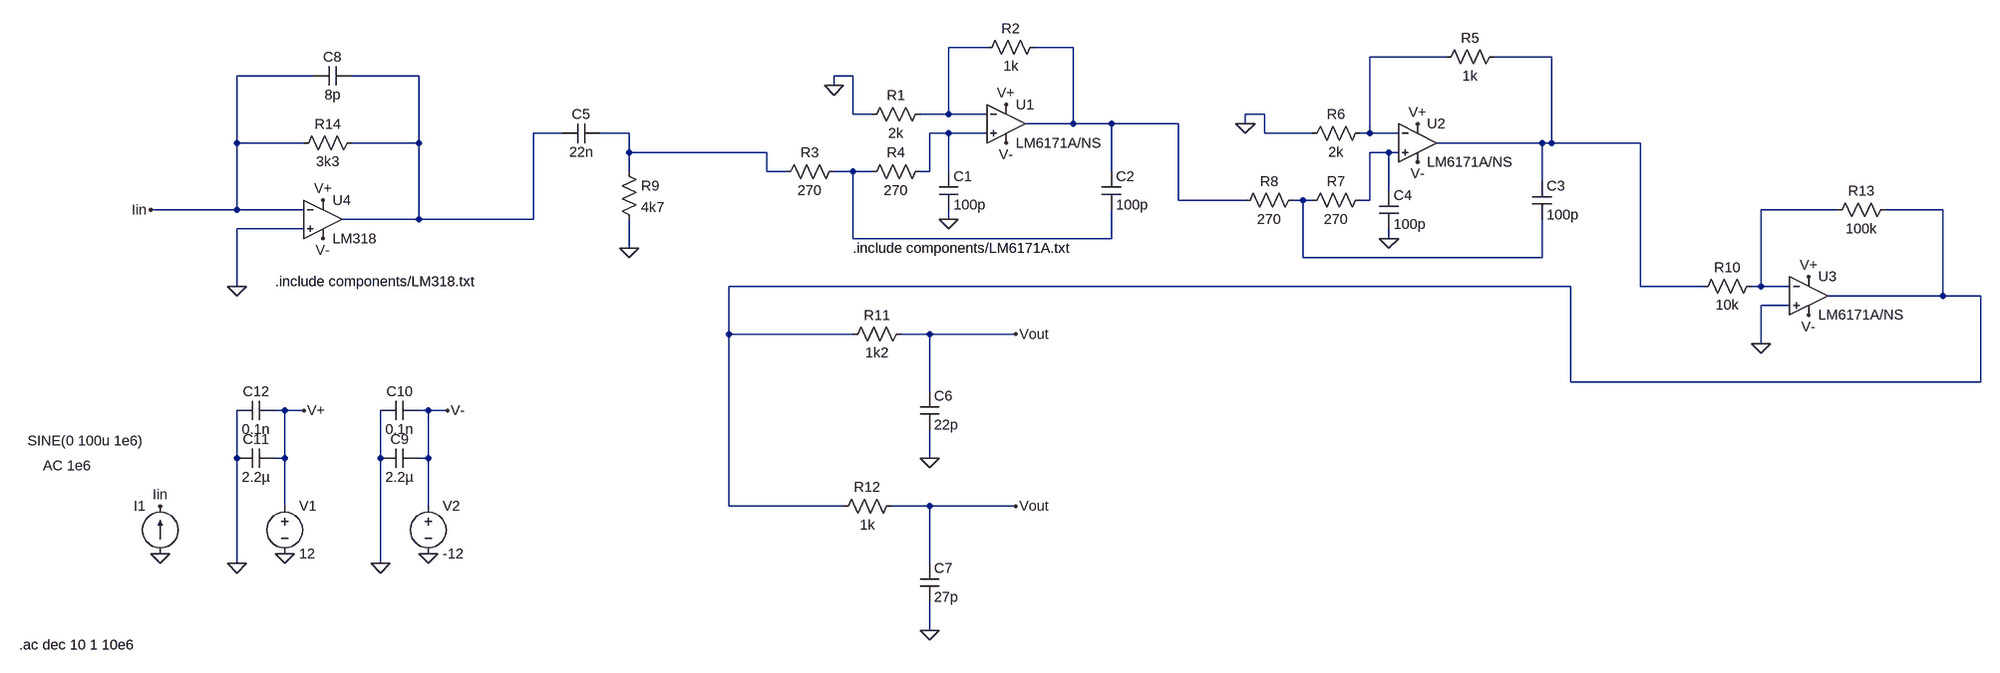
[diagram p0: schematic stage-4-LM318-sullen-key-linked.asc]
stage-4-LM318-sullen-key-linked.asc, the LTspice schematic file:
Version 4
SHEET 1 1972 1252
WIRE 176 32 112 32
WIRE 320 32 256 32
WIRE 944 48 816 48
WIRE 1120 48 1024 48
WIRE -992 80 -1120 80
WIRE -816 80 -928 80
WIRE -48 80 -80 80
WIRE -80 96 -80 80
WIRE -48 144 -48 80
WIRE -16 144 -48 144
WIRE 112 144 112 32
WIRE 112 144 64 144
WIRE 176 144 112 144
WIRE 640 144 608 144
WIRE 320 160 320 32
WIRE 320 160 240 160
WIRE 384 160 320 160
WIRE 496 160 384 160
WIRE 608 160 608 144
WIRE -576 176 -624 176
WIRE -464 176 -512 176
WIRE 112 176 80 176
WIRE 176 176 112 176
WIRE 640 176 640 144
WIRE 720 176 640 176
WIRE 816 176 816 48
WIRE 816 176 800 176
WIRE 864 176 816 176
WIRE -1120 192 -1120 80
WIRE -1008 192 -1120 192
WIRE -816 192 -816 80
WIRE -816 192 -928 192
WIRE 1104 192 928 192
WIRE 1120 192 1120 48
WIRE 1120 192 1104 192
WIRE 1280 192 1120 192
WIRE -464 208 -464 176
WIRE -192 208 -464 208
WIRE 848 208 816 208
WIRE 864 208 848 208
WIRE -464 240 -464 208
WIRE -192 240 -192 208
WIRE -160 240 -192 240
WIRE -48 240 -80 240
WIRE -16 240 -48 240
WIRE 80 240 80 176
WIRE 80 240 64 240
WIRE 112 240 112 176
WIRE 384 240 384 160
WIRE 1104 256 1104 192
WIRE 848 272 848 208
WIRE 496 288 496 160
WIRE 608 288 496 288
WIRE 704 288 688 288
WIRE 720 288 704 288
WIRE 816 288 816 208
WIRE 816 288 800 288
WIRE -1120 304 -1120 192
WIRE -1120 304 -1264 304
WIRE -1008 304 -1120 304
WIRE 1648 304 1520 304
WIRE 1824 304 1728 304
WIRE -816 320 -816 192
WIRE -816 320 -944 320
WIRE -624 320 -624 176
WIRE -624 320 -816 320
WIRE 112 320 112 304
WIRE -1008 336 -1120 336
WIRE -48 352 -48 240
WIRE 384 352 384 304
WIRE 384 352 -48 352
WIRE 848 352 848 336
WIRE -464 368 -464 320
WIRE 704 384 704 288
WIRE 1104 384 1104 320
WIRE 1104 384 704 384
WIRE -1120 432 -1120 336
WIRE 1152 432 -256 432
WIRE 1280 432 1280 192
WIRE 1424 432 1280 432
WIRE 1520 432 1520 304
WIRE 1520 432 1504 432
WIRE 1568 432 1520 432
WIRE 1824 448 1824 304
WIRE 1824 448 1632 448
WIRE 1888 448 1824 448
WIRE 1568 464 1520 464
WIRE -256 512 -256 432
WIRE -48 512 -256 512
WIRE 80 512 32 512
WIRE 224 512 80 512
WIRE 1520 528 1520 464
WIRE 1152 592 1152 432
WIRE 1888 592 1888 448
WIRE 1888 592 1152 592
WIRE 80 608 80 512
WIRE -1040 640 -1056 640
WIRE -1008 640 -1040 640
WIRE -800 640 -816 640
WIRE -768 640 -800 640
WIRE -1120 720 -1120 640
WIRE -1040 720 -1040 640
WIRE -1040 720 -1056 720
WIRE -880 720 -880 640
WIRE -800 720 -800 640
WIRE -800 720 -816 720
WIRE 80 720 80 672
WIRE -1040 800 -1040 720
WIRE -800 800 -800 720
WIRE -256 800 -256 512
WIRE -64 800 -256 800
WIRE 80 800 16 800
WIRE 224 800 80 800
WIRE -1120 896 -1120 720
WIRE -880 896 -880 720
WIRE 80 896 80 800
WIRE 80 1008 80 960
FLAG 112 320 0
FLAG -80 96 0
FLAG -1264 304 Iin
FLAG 208 128 V+
FLAG 208 192 V-
FLAG -1040 880 0
FLAG -800 880 0
FLAG -1008 640 V+
FLAG -768 640 V-
FLAG -1248 800 Iin
FLAG 608 160 0
FLAG 848 352 0
FLAG -464 368 0
FLAG 896 160 V+
FLAG 896 224 V-
FLAG 1600 416 V+
FLAG 1600 480 V-
FLAG 1520 528 0
FLAG 80 1008 0
FLAG 80 720 0
FLAG -976 288 V+
FLAG -976 352 V-
FLAG -1120 432 0
FLAG 224 512 Vout
FLAG 224 800 Vout
FLAG -880 896 0
FLAG -1120 896 0
FLAG -1248 880 0
SYMBOL OpAmps\\opamp2 208 96 R0
SYMATTR InstName U1
SYMATTR Value LM6171A/NS
SYMBOL res 80 128 R90
WINDOW 0 0 56 VBottom 2
WINDOW 3 32 56 VTop 2
SYMATTR InstName R1
SYMATTR Value 2k
SYMBOL res 272 16 R90
WINDOW 0 0 56 VBottom 2
WINDOW 3 32 56 VTop 2
SYMATTR InstName R2
SYMATTR Value 1k
SYMBOL res 80 224 R90
WINDOW 0 0 56 VBottom 2
WINDOW 3 32 56 VTop 2
SYMATTR InstName R4
SYMATTR Value 270
SYMBOL res -64 224 R90
WINDOW 0 0 56 VBottom 2
WINDOW 3 32 56 VTop 2
SYMATTR InstName R3
SYMATTR Value 270
SYMBOL cap 96 240 R0
SYMATTR InstName C1
SYMATTR Value 100p
SYMBOL cap 368 240 R0
SYMATTR InstName C2
SYMATTR Value 100p
SYMBOL voltage -1040 784 R0
WINDOW 123 0 0 Left 0
WINDOW 39 0 0 Left 0
SYMATTR InstName V1
SYMATTR Value 12
SYMBOL voltage -800 784 R0
WINDOW 123 0 0 Left 0
WINDOW 39 0 0 Left 0
SYMATTR InstName V2
SYMATTR Value -12
SYMBOL res 816 160 R90
WINDOW 0 0 56 VBottom 2
WINDOW 3 32 56 VTop 2
SYMATTR InstName R6
SYMATTR Value 2k
SYMBOL res 816 272 R90
WINDOW 0 0 56 VBottom 2
WINDOW 3 32 56 VTop 2
SYMATTR InstName R7
SYMATTR Value 270
SYMBOL res 704 272 R90
WINDOW 0 0 56 VBottom 2
WINDOW 3 32 56 VTop 2
SYMATTR InstName R8
SYMATTR Value 270
SYMBOL cap 832 272 R0
SYMATTR InstName C4
SYMATTR Value 100p
SYMBOL OpAmps\\opamp2 896 128 R0
SYMATTR InstName U2
SYMATTR Value LM6171A/NS
SYMBOL res 1040 32 R90
WINDOW 0 0 56 VBottom 2
WINDOW 3 32 56 VTop 2
SYMATTR InstName R5
SYMATTR Value 1k
SYMBOL cap 1088 256 R0
SYMATTR InstName C3
SYMATTR Value 100p
SYMBOL cap -512 160 R90
WINDOW 0 0 32 VBottom 2
WINDOW 3 32 32 VTop 2
SYMATTR InstName C5
SYMATTR Value 22n
SYMBOL res -480 224 R0
SYMATTR InstName R9
SYMATTR Value 4k7
SYMBOL res 1520 416 R90
WINDOW 0 0 56 VBottom 2
WINDOW 3 32 56 VTop 2
SYMATTR InstName R10
SYMATTR Value 10k
SYMBOL OpAmps\\opamp2 1600 384 R0
SYMATTR InstName U3
SYMATTR Value LM6171A/NS
SYMBOL res 1744 288 R90
WINDOW 0 0 56 VBottom 2
WINDOW 3 32 56 VTop 2
SYMATTR InstName R13
SYMATTR Value 100k
SYMBOL res 48 496 R90
WINDOW 0 0 56 VBottom 2
WINDOW 3 32 56 VTop 2
SYMATTR InstName R11
SYMATTR Value 1k2
SYMBOL res 32 784 R90
WINDOW 0 0 56 VBottom 2
WINDOW 3 32 56 VTop 2
SYMATTR InstName R12
SYMATTR Value 1k
SYMBOL cap 64 608 R0
SYMATTR InstName C6
SYMATTR Value 22p
SYMBOL cap 64 896 R0
SYMATTR InstName C7
SYMATTR Value 27p
SYMBOL OpAmps\\opamp2 -976 256 R0
SYMATTR InstName U4
SYMATTR Value LM318
SYMBOL cap -928 64 R90
WINDOW 0 0 32 VBottom 2
WINDOW 3 32 32 VTop 2
SYMATTR InstName C8
SYMATTR Value 8p
SYMBOL res -912 176 R90
WINDOW 0 0 56 VBottom 2
WINDOW 3 32 56 VTop 2
SYMATTR InstName R14
SYMATTR Value 3k3
SYMBOL cap -816 704 R90
WINDOW 0 0 32 VBottom 2
WINDOW 3 32 32 VTop 2
SYMATTR InstName C9
SYMATTR Value 2.2µ
SYMBOL cap -816 624 R90
WINDOW 0 0 32 VBottom 2
WINDOW 3 32 32 VTop 2
SYMATTR InstName C10
SYMATTR Value 0.1n
SYMBOL cap -1056 704 R90
WINDOW 0 0 32 VBottom 2
WINDOW 3 32 32 VTop 2
SYMATTR InstName C11
SYMATTR Value 2.2µ
SYMBOL cap -1056 624 R90
WINDOW 0 0 32 VBottom 2
WINDOW 3 32 32 VTop 2
SYMATTR InstName C12
SYMATTR Value 0.1n
SYMBOL current -1248 880 R180
WINDOW 0 24 80 Left 2
WINDOW 3 28 189 Left 2
WINDOW 123 116 148 Left 2
WINDOW 39 0 0 Left 0
SYMATTR InstName I1
SYMATTR Value SINE(0 100u 1e6)
SYMATTR Value2 AC 1e6
TEXT -48 368 Left 2 !.include components/LM6171A.txt
TEXT -1056 424 Left 2 !.include components/LM318.txt
TEXT -1484 1032 Left 2 !.ac dec 10 1 10e6

The netlist it stands for:
* stage-4-LM318-sullen-key-linked.asc
XU1 N007 N001 V+ V- N002 LM6171A/NS  ; pins In+ In- V+ V- OUT
R1 N001 0 2k
R2 N002 N001 1k
R4 N007 N009 270
R3 N009 N006 270
C1 N007 0 100p
C2 N002 N009 100p
V1 V+ 0 12
V2 V- 0 -12
R6 N003 0 2k
R7 N008 N010 270
R8 N010 N002 270
C4 N008 0 100p
XU2 N008 N003 V+ V- N004 LM6171A/NS  ; pins In+ In- V+ V- OUT
R5 N004 N003 1k
C3 N004 N010 100p
C5 N006 N005 22n
R9 N006 0 4k7
R10 N011 N004 10k
XU3 0 N011 V+ V- N012 LM6171A/NS  ; pins In+ In- V+ V- OUT
R13 N012 N011 100k
R11 Vout N012 1k2
R12 Vout N012 1k
C6 Vout 0 22p
C7 Vout 0 27p
XU4 0 Iin V+ V- N005 LM318  ; pins In+ In- V+ V- OUT
C8 N005 Iin 8p
R14 N005 Iin 3k3
C9 V- 0 2.2µ
C10 V- 0 0.1n
C11 V+ 0 2.2µ
C12 V+ 0 0.1n
I1 0 Iin SINE(0 100u 1e6) AC 1e6
.include components/LM6171A.txt
.include components/LM318.txt
.ac dec 10 1 10e6
.backanno
.end